# EAGLE schematic mouse1351r3-singlesided (EAGLE 5.11)
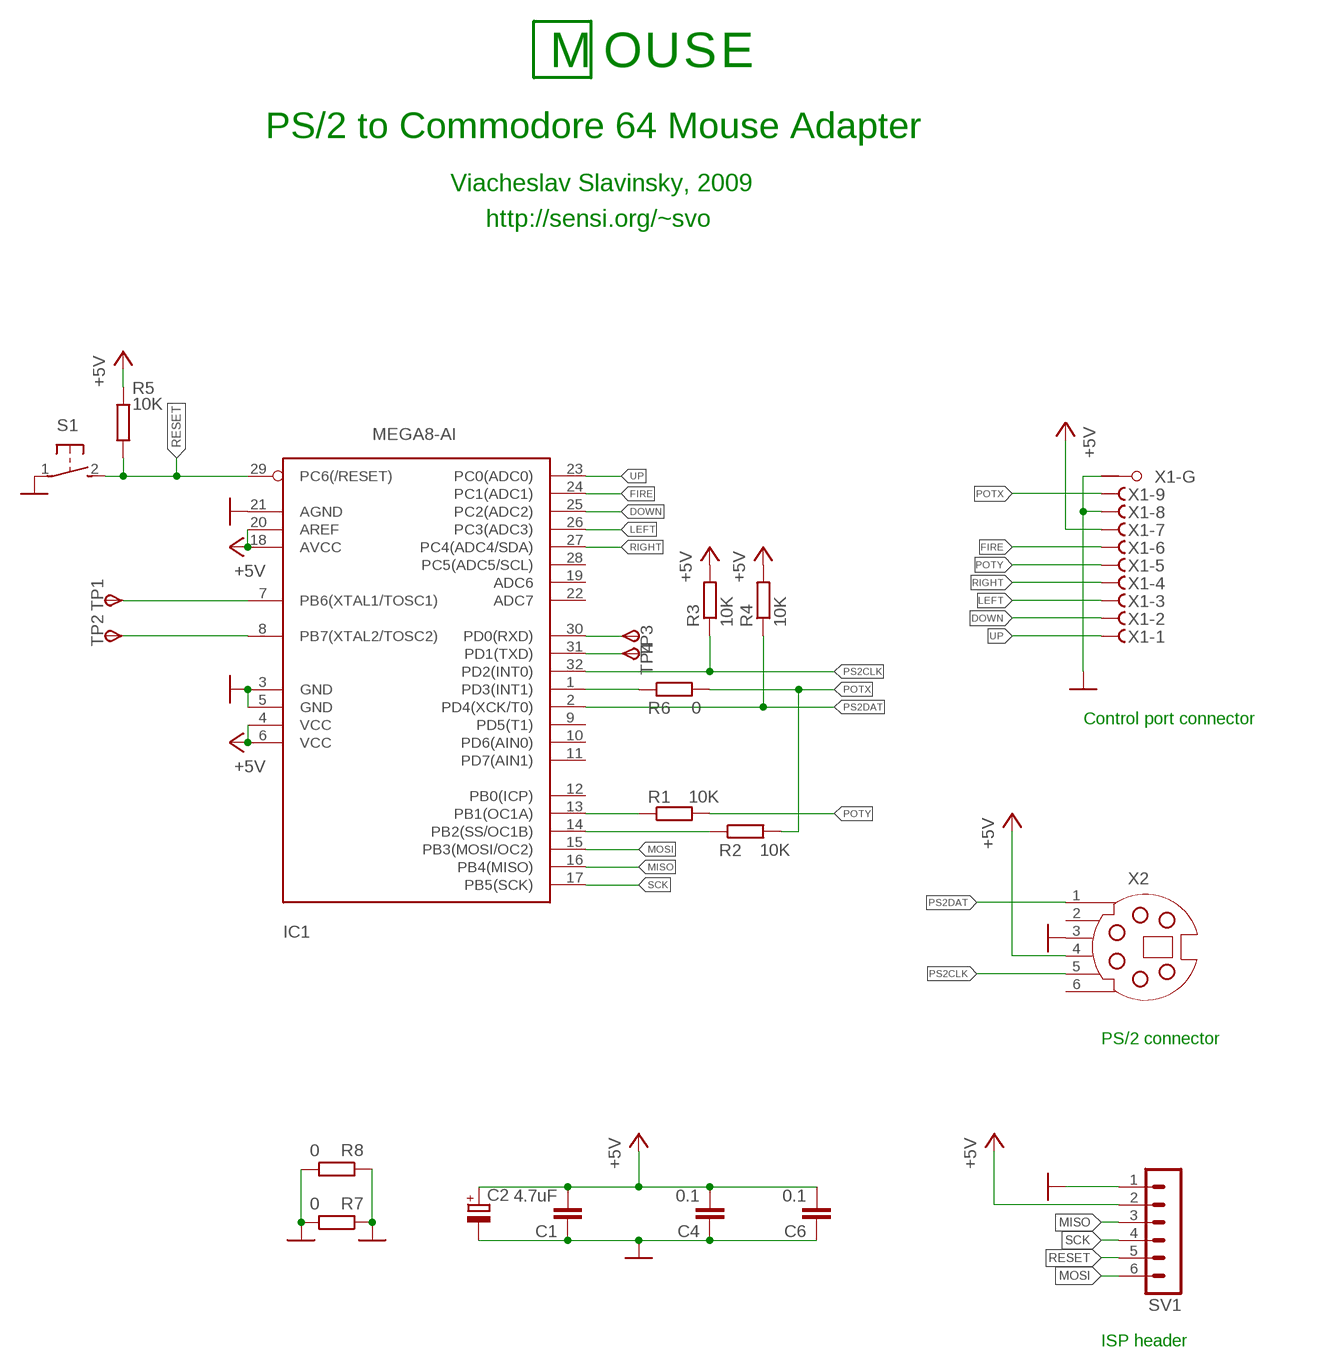
[diagram p0: schematic, sheet 1]

## Parts
C1  4.7uF  C-EUC0805K  [C0805K]
C2  CPOL-EUSMCB  [SMC_B]
C4  0.1  C-EUC0603K  [C0603K]
C6  0.1  C-EUC0603K  [C0603K]
IC1  MEGA8-AI  [TQFP32-08]
R1  10K  R-EU_R0805  [R0805]
R2  10K  R-EU_R0805  [R0805]
R3  10K  R-EU_R0805  [R0805]
R4  10K  R-EU_R0805  [R0805]
R5  10K  R-EU_R0805  [R0805]
R6  0  R-EU_R0805  [R0805]
R7  0  R-EU_R0805  [R0805]
R8  0  R-EU_R0805  [R0805]
S1  31-XX  [B3F-31XX]
SV1  MA06-1  [MA06-1]
TP1  TPSTP06R  [TP06R]
TP2  TPSTP06R  [TP06R]
TP3  TPSB1,27  [B1,27]
TP4  TPSB1,27  [B1,27]
X1  F09HPS  [F09HP]
X2  SSV-G06  [SSV-BC06]

## Nets
+5V: C1.2 C2.+ C4.2 C6.2 IC1.4(VCC) IC1.6(VCC) IC1.18(AVCC) IC1.20(AREF) R3.2 R4.2 R5.2 SV1.2 X1.7(-7:F) X2.4
DOWN: IC1.25(PC2(ADC2)) X1.2(-2:F)
FIRE: IC1.24(PC1(ADC1)) X1.6(-6:F)
GND: C1.1 C2.- C4.1 C6.1 IC1.3(GND) IC1.5(GND) IC1.21(AGND) R7.1 R7.2 R8.1 R8.2 S1.1(P) SV1.1 X1.8(-8:F) X1.G1(-G:G1) X2.3
LEFT: IC1.26(PC3(ADC3)) X1.3(-3:F)
MISO: IC1.16(PB4(MISO)) SV1.3
MOSI: IC1.15(PB3(MOSI/OC2)) SV1.6
N$1: IC1.1(PD3(INT1)) R6.1
N$2: IC1.7(PB6(XTAL1/TOSC1)) TP1.TP(PP)
N$3: IC1.8(PB7(XTAL2/TOSC2)) TP2.TP(PP)
N$4: IC1.13(PB1(OC1A)) R1.1
N$5: IC1.14(PB2(SS/OC1B)) R2.1
POTX: R2.2 R6.2 X1.9(-9:F)
POTY: R1.2 X1.5(-5:F)
PS2CLK: IC1.32(PD2(INT0)) R3.1 X2.5
PS2DAT: IC1.2(PD4(XCK/T0)) R4.1 X2.1
RESET: IC1.29(PC6(/RESET)) R5.1 S1.2(S) SV1.5
RIGHT: IC1.27(PC4(ADC4/SDA)) X1.4(-4:F)
RXD: IC1.30(PD0(RXD)) TP3.PP
SCK: IC1.17(PB5(SCK)) SV1.4
TXD: IC1.31(PD1(TXD)) TP4.PP
UP: IC1.23(PC0(ADC0)) X1.1(-1:F)
Unconnected: IC1.9(PD5(T1)) IC1.10(PD6(AIN0)) IC1.11(PD7(AIN1)) IC1.12(PB0(ICP)) IC1.19(ADC6) IC1.22(ADC7) IC1.28(PC5(ADC5/SCL)) X1.G2(-G:G2) X2.2 X2.6

## Notes on the sheet
- M | O | U | S | E
- PS/2 to Commodore 64 Mouse Adapter
- Viacheslav Slavinsky, 2009
- http://sensi.org/~svo
- Control port connector
- PS/2 connector
- ISP header

## Library data of the parts
C1 C4 C6 = rcl:C-EU: CAPACITOR, European symbol
C2 = rcl:CPOL-EU: POLARIZED CAPACITOR, European symbol
IC1 = atmel:MEGA8: MICROCONTROLLER 8 Kbytes FLASH, 1 kbytes SRAM, 512 bytes EEPROM, USART, 6-channel 10 bit ADC, 2-channel 8 bit ADC Pin compatible with Atmega48, ATMega88, ATMega168 Source: avr.lbr
R1-R8 = rcl:R-EU_: RESISTOR, European symbol
S1 = switch-omron:31-XX: OMRON SWITCH; MPN: B3F-3100; OC_FARNELL: 959704; OC_NEWARK: 36M3582
SV1 = con-lstb:MA06-1: PIN HEADER
TP1-TP4 = 0-svo:TPS: TEST PIN
X1 = con-subd:F09HPS: SUB-D
X2 = 0-svo:SSV-G06: YAMAICHI CONNECTOR